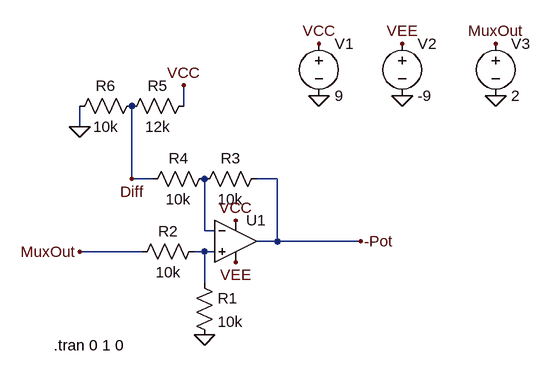
[diagram p0: schematic Draft1.asc]
Draft1.asc, the LTspice schematic file:
Version 4.1
SHEET 1 880 680
WIRE 160 -48 160 -80
WIRE 0 -16 0 -48
WIRE 80 64 80 -48
WIRE 112 64 80 64
WIRE 304 64 272 64
WIRE 192 144 192 64
WIRE 208 144 192 144
WIRE 304 160 304 64
WIRE 304 160 272 160
WIRE 432 160 304 160
WIRE 96 176 0 176
WIRE 192 176 176 176
WIRE 208 176 192 176
WIRE 192 224 192 176
FLAG 240 128 VCC
FLAG 240 192 VEE
FLAG 192 304 0
FLAG 432 160 -Pot
FLAG 0 -16 0
FLAG 0 176 MuxOut
FLAG 368 -64 0
FLAG 368 -144 VCC
FLAG 496 -64 0
FLAG 496 -144 VEE
FLAG 640 -64 0
FLAG 640 -144 MuxOut
FLAG 160 -80 VCC
FLAG 80 64 Diff
SYMBOL OpAmps\\UniversalOpAmp2 240 160 R0
SYMATTR InstName U1
SYMBOL res 176 208 R0
SYMATTR InstName R1
SYMATTR Value 10k
SYMBOL res 192 160 R90
WINDOW 0 0 56 VBottom 2
WINDOW 3 32 56 VTop 2
SYMATTR InstName R2
SYMATTR Value 10k
SYMBOL res 288 48 R90
WINDOW 0 0 56 VBottom 2
WINDOW 3 32 56 VTop 2
SYMATTR InstName R3
SYMATTR Value 10k
SYMBOL res 208 48 R90
WINDOW 0 0 56 VBottom 2
WINDOW 3 32 56 VTop 2
SYMATTR InstName R4
SYMATTR Value 10k
SYMBOL res 176 -64 R90
WINDOW 0 0 56 VBottom 2
WINDOW 3 32 56 VTop 2
SYMATTR InstName R5
SYMATTR Value 12k
SYMBOL res 96 -64 R90
WINDOW 0 0 56 VBottom 2
WINDOW 3 32 56 VTop 2
SYMATTR InstName R6
SYMATTR Value 10k
SYMBOL voltage 368 -160 R0
WINDOW 123 0 0 Left 0
WINDOW 39 0 0 Left 0
SYMATTR InstName V1
SYMATTR Value 9
SYMBOL voltage 496 -160 R0
WINDOW 123 0 0 Left 0
WINDOW 39 0 0 Left 0
SYMATTR InstName V2
SYMATTR Value -9
SYMBOL voltage 640 -160 R0
WINDOW 123 0 0 Left 0
WINDOW 39 0 0 Left 0
SYMATTR InstName V3
SYMATTR Value 2
TEXT -40 320 Left 2 !.tran 0 1 0

The netlist it stands for:
* Draft1.asc
X§U1 N002 N001 VCC VEE -Pot level2 Avol=1Meg GBW=10Meg Slew=10Meg Ilimit=25m Rail=0 Vos=0 En=0 Enk=0 In=0 Ink=0 Rin=500Meg  ; pins In+ In- V+ V- OUT
R1 N002 0 10k
R2 N002 MuxOut 10k
R3 -Pot N001 10k
R4 N001 Diff 10k
R5 VCC Diff 12k
R6 Diff 0 10k
V1 VCC 0 9
V2 VEE 0 -9
V3 MuxOut 0 2
.tran 0 1 0
.lib UniversalOpAmp2.lib
.backanno
.end